# Altium project SnippetsPower.PrjPCB
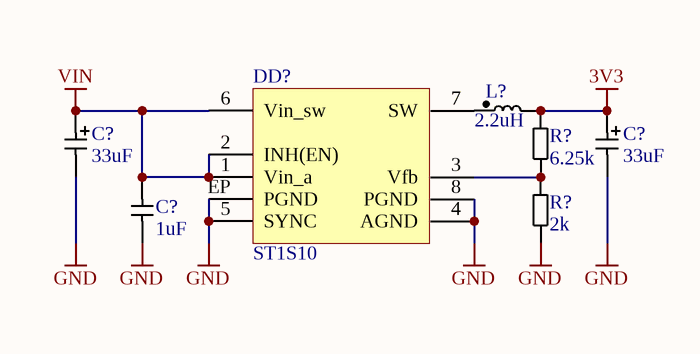
[diagram p0: DCDC_ST1S10_3V3.SchDoc]
8 sheets, 83 parts. Net scope: global (net labels, ports and power ports of the same name join across sheets).
Sheets:
  DCDC_ST1S10_3V3.SchDoc
  DCDC_ST1S10_3V3_small.SchDoc
  Measurement_CS5463_simple.SchDoc
  DCDC_TPS62200_3V3.SchDoc
  DCDC_TPS62410_1V1_1V2.SchDoc
  DCDC_TPS62410_1V8_2V5.SchDoc
  LDO_LP2992IM5_3V3.SchDoc
  DCDC_ST1S14_3.3V.SchDoc

## Sheet DCDC_ST1S10_3V3.SchDoc
size A4

### Parts
(Parts that share a designator on the sheet are numbered #1, #2 ... from top to bottom, then left to right.)
C?#1  33uF  [C_EL_6.3]
C?#2  33uF  [C_EL_6.3]
C?#3  1uF  [C0603]
DD?#1  ST1S10  [SO-8EP]
L?#1  2.2uH  [SDR0403]
R?#1  6.25k  [R0603]
R?#2  2k  [R0603]

### Nets
3V3: C?#2.1 L?#1.2 R?#1.2
GND: C?#1.2 C?#2.2 C?#3.2 DD?#1.4(AGND) DD?#1.5(SYNC) DD?#1.8(PGND) DD?#1.EP(PGND) R?#2.1  [project net HOT_L_IN]
VIN: C?#1.1 C?#3.1 DD?#1.1(Vin_a) DD?#1.2(INH(EN)) DD?#1.6(Vin_sw)
NetDD?#1_3: DD?#1.3(Vfb) R?#1.1 R?#2.2
NetDD?#1_7: DD?#1.7(SW) L?#1.1

### Library data of the parts
C?#1 C?#2 = CP: Capacitor polarized
C?#3 = C: Capacitor
DD?#1 = ST1S10: ST DC-DC Converter
L?#1 = L: Inductor
R?#1 R?#2 = R: Resistor

## Sheet DCDC_ST1S10_3V3_small.SchDoc
size A4
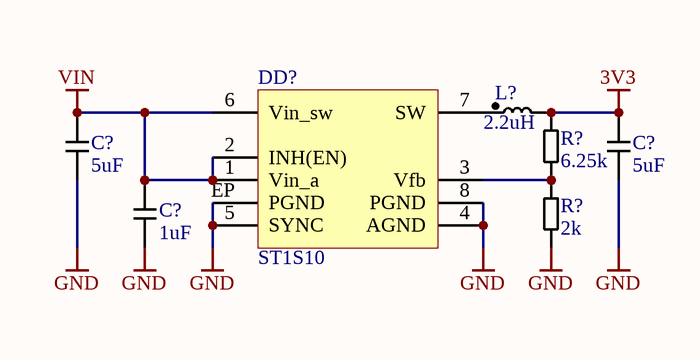
[diagram p1: DCDC_ST1S10_3V3_small.SchDoc]

### Parts
(Parts that share a designator on the sheet are numbered #1, #2 ... from top to bottom, then left to right.)
C?#4  5uF  [C0603]
C?#5  5uF  [C0603]
C?#6  1uF  [C0603]
DD?#2  ST1S10  [SO-8EP]
L?#2  2.2uH  [SDR0403]
R?#3  6.25k  [R0603]
R?#4  2k  [R0603]

### Nets
3V3: C?#5.1 L?#2.2 R?#3.2
GND: C?#4.2 C?#5.2 C?#6.2 DD?#2.4(AGND) DD?#2.5(SYNC) DD?#2.8(PGND) DD?#2.EP(PGND) R?#4.1  [project net HOT_L_IN]
VIN: C?#4.1 C?#6.1 DD?#2.1(Vin_a) DD?#2.2(INH(EN)) DD?#2.6(Vin_sw)
NetDD?#2_3: DD?#2.3(Vfb) R?#3.1 R?#4.2
NetDD?#2_7: DD?#2.7(SW) L?#2.1

### Library data of the parts
C?#4-C?#6 = C: Capacitor
DD?#2 = ST1S10: ST DC-DC Converter
L?#2 = L: Inductor
R?#3 R?#4 = R: Resistor

## Sheet Measurement_CS5463_simple.SchDoc
size A4
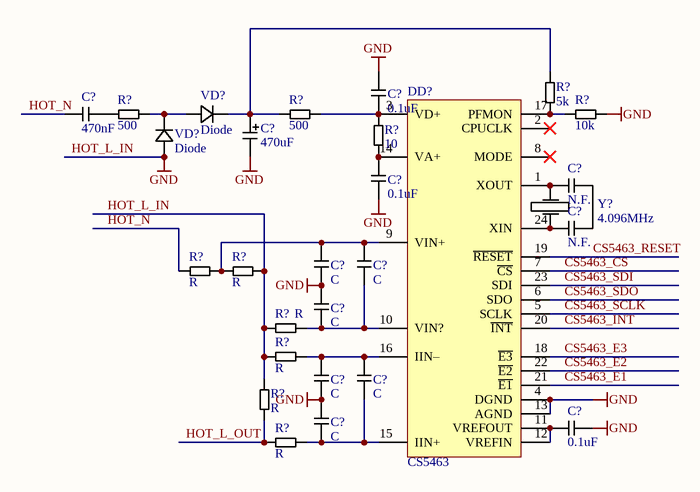
[diagram p2: Measurement_CS5463_simple.SchDoc]

### Parts
(Parts that share a designator on the sheet are numbered #1, #2 ... from top to bottom, then left to right.)
C?#7  0.1uF  [C0603]
C?#8  470nF  [C0603]
C?#9  470uF  [C_EL_6.3]
C?#10  0.1uF  [C0603]
C?#11  N.F.  [C0603]
C?#12  N.F.  [C0603]
C?#13  C  [C0603]
C?#14  C  [C0603]
C?#15  C  [C0603]
C?#16  C  [C0603]
C?#17  C  [C0603]
C?#18  C  [C0603]
C?#19  0.1uF  [C0603]
DD?#3  CS5463  [TSSOP-24]
R?#5  5k  [R0603]
R?#6  500  [R0603]
R?#7  500  [R0603]
R?#8  10k  [R0603]
R?#9  10  [R0603]
R?#10  R  [R0603]
R?#11  R  [R0603]
R?#12  R  [R0603]
R?#13  R  [R0603]
R?#14  R  [R0805]
R?#15  R  [R0603]
VD?#1  Diode  [SOD-123]
VD?#2  Diode  [SOD-123]
Y?  4.096MHz  [Xtal 0532]

### Nets
HOT_L_IN: C?#7.1 C?#9.2 C?#10.2 C?#13.2 C?#15.1 C?#16.2 C?#18.1 C?#19.2 DD?#3.4(DGND) DD?#3.13(AGND) R?#8.2 R?#11.2 R?#12.1 R?#13.1 R?#14.2 VD?#2.1(K)  [also labelled GND]
CS5463_CS: DD?#3.7(~{CS})
CS5463_E1: DD?#3.21(~{E1})
CS5463_E2: DD?#3.22(~{E2})
CS5463_E3: DD?#3.18(~{E3})
CS5463_INT: DD?#3.20(~{INT})
CS5463_RESET: DD?#3.19(~{RESET})
CS5463_SCLK: DD?#3.5(SCLK)
CS5463_SDI: DD?#3.23(SDI)
CS5463_SDO: DD?#3.6(SDO)
HOT_L_OUT: R?#14.1 R?#15.1
HOT_N: C?#8.1 R?#10.1
NetC?#7_2: C?#7.2 DD?#3.3(VD+) R?#7.2 R?#9.2
NetC?#8_2: C?#8.2 R?#6.1
NetC?#9_1: C?#9.1 R?#5.2 R?#7.1 VD?#1.2(A)
NetC?#10_1: C?#10.1 DD?#3.14(VA+) R?#9.1
NetC?#11_1: C?#11.1 DD?#3.1(XOUT) Y?.4(GND)
NetC?#11_2: C?#11.2 Y?.3(X2)
NetC?#12_1: C?#12.1 DD?#3.24(XIN) Y?.2(GND)
NetC?#12_2: C?#12.2 Y?.1(X1)
NetC?#13_1: C?#13.1 C?#14.1 DD?#3.9(VIN+) R?#10.2 R?#11.1
NetC?#14_2: C?#14.2 C?#15.2 DD?#3.10(VIN?) R?#12.2
NetC?#16_1: C?#16.1 C?#17.1 DD?#3.16(IIN–) R?#13.2
NetC?#17_2: C?#17.2 C?#18.2 DD?#3.15(IIN+) R?#15.2
NetC?#19_1: C?#19.1 DD?#3.11(VREFOUT) DD?#3.12(VREFIN)
NetDD?#3_17: DD?#3.17(PFMON) R?#5.1 R?#8.1
NetR?#6_2: R?#6.2 VD?#1.1(K) VD?#2.2(A)

Not connected (* = marked no-connect by the designer): DD?#3 2(CPUCLK)* 8(MODE)*

### Library data of the parts
C?#7 C?#8 C?#10-C?#19 = C: Capacitor
C?#9 = CP: Capacitor polarized
DD?#3 = CS5463: Power/Energy metering IC
R?#5-R?#15 = R: Resistor
VD?#1 VD?#2 = Diode: SMD diode
Y? = Xtal: Quartz crystal

## Sheet DCDC_TPS62200_3V3.SchDoc
size A4
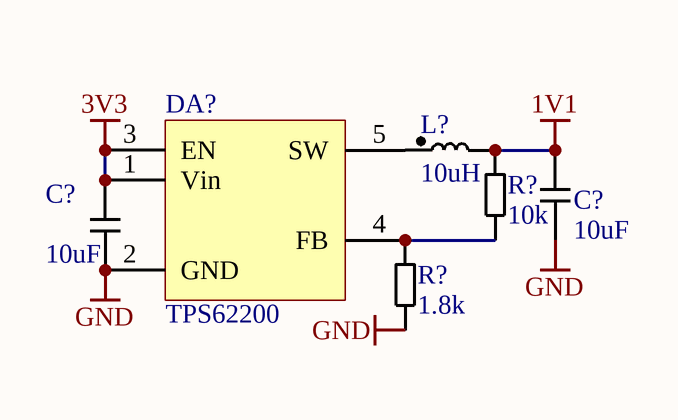
[diagram p3: DCDC_TPS62200_3V3.SchDoc]

### Parts
(Parts that share a designator on the sheet are numbered #1, #2 ... from top to bottom, then left to right.)
C?#20  10uF  [C0603]
C?#21  10uF  [C0603]
DA?#1  TPS62200  [SOT-23-5]
L?#3  10uH  [L0805]
R?#16  10k  [R0603]
R?#17  1.8k  [R0603]

### Nets
1V1: C?#20.1 L?#3.2 R?#16.2
3V3: C?#21.1 DA?#1.1(Vin) DA?#1.3(EN)
GND: C?#20.2 C?#21.2 DA?#1.2(GND) R?#17.1  [project net HOT_L_IN]
NetDA?#1_4: DA?#1.4(FB) R?#16.1 R?#17.2
NetDA?#1_5: DA?#1.5(SW) L?#3.1

### Library data of the parts
C?#20 C?#21 = C: Capacitor
DA?#1 = TPS62200: TI DC-DC buck 300ma SOT-23-5 package
L?#3 = L: Inductor
R?#16 R?#17 = R: Resistor

## Sheet DCDC_TPS62410_1V1_1V2.SchDoc
size A4
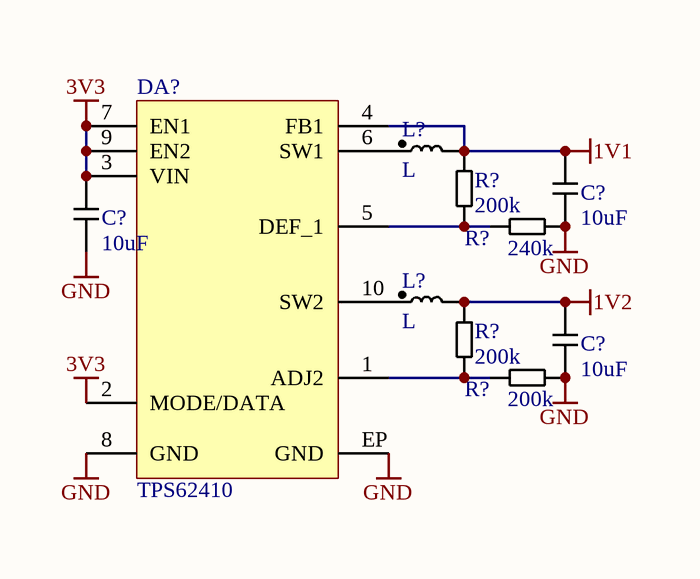
[diagram p4: DCDC_TPS62410_1V1_1V2.SchDoc]

### Parts
(Parts that share a designator on the sheet are numbered #1, #2 ... from top to bottom, then left to right.)
C?#22  10uF  [C0603]
C?#23  10uF  [C0603]
C?#24  10uF  [C0603]
DA?#2  TPS62410  [VSON-10]
L?#4  L  [L0603]
L?#5  L  [L0603]
R?#18  200k  [R0603]
R?#19  240k  [R0603]
R?#20  200k  [R0603]
R?#21  200k  [R0603]

### Nets
1V1: C?#22.1 DA?#2.4(FB1) L?#4.2 R?#18.2
1V2: C?#24.1 L?#5.2 R?#20.2
3V3: C?#23.1 DA?#2.2(MODE/DATA) DA?#2.3(VIN) DA?#2.7(EN1) DA?#2.9(EN2)
GND: C?#22.2 C?#23.2 C?#24.2 DA?#2.8(GND) DA?#2.EP(GND) R?#19.1 R?#21.1  [project net HOT_L_IN]
NetDA?#2_1: DA?#2.1(ADJ2) R?#20.1 R?#21.2
NetDA?#2_5: DA?#2.5(DEF_1) R?#18.1 R?#19.2
NetDA?#2_6: DA?#2.6(SW1) L?#4.1
NetDA?#2_10: DA?#2.10(SW2) L?#5.1

### Library data of the parts
C?#22-C?#24 = C: Capacitor
DA?#2 = TPS62410: TI 2 channel DC-DC buck
L?#4 L?#5 = L: Inductor
R?#18-R?#21 = R: Resistor

## Sheet DCDC_TPS62410_1V8_2V5.SchDoc
size A4
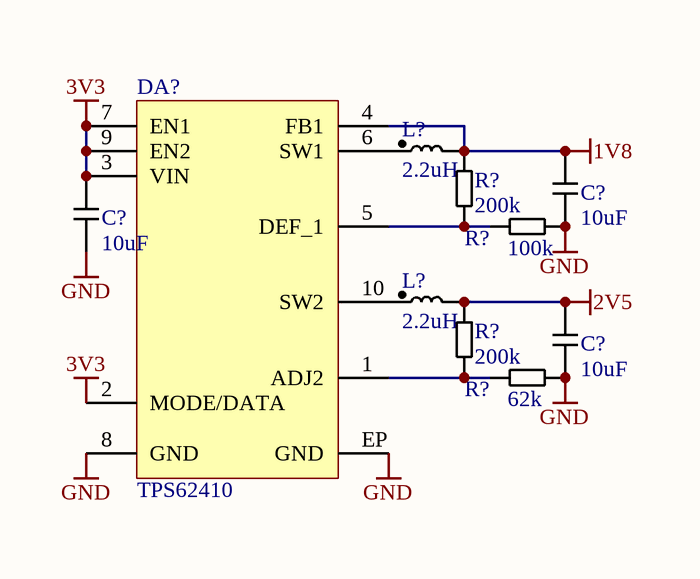
[diagram p5: DCDC_TPS62410_1V8_2V5.SchDoc]

### Parts
(Parts that share a designator on the sheet are numbered #1, #2 ... from top to bottom, then left to right.)
C?#25  10uF  [C0603]
C?#26  10uF  [C0603]
C?#27  10uF  [C0603]
DA?#3  TPS62410  [VSON-10]
L?#6  2.2uH  [L0603]
L?#7  2.2uH  [L0603]
R?#22  200k  [R0603]
R?#23  100k  [R0603]
R?#24  200k  [R0603]
R?#25  62k  [R0603]

### Nets
1V8: C?#25.1 DA?#3.4(FB1) L?#6.2 R?#22.2
2V5: C?#27.1 L?#7.2 R?#24.2
3V3: C?#26.1 DA?#3.2(MODE/DATA) DA?#3.3(VIN) DA?#3.7(EN1) DA?#3.9(EN2)
GND: C?#25.2 C?#26.2 C?#27.2 DA?#3.8(GND) DA?#3.EP(GND) R?#23.1 R?#25.1  [project net HOT_L_IN]
NetDA?#3_1: DA?#3.1(ADJ2) R?#24.1 R?#25.2
NetDA?#3_5: DA?#3.5(DEF_1) R?#22.1 R?#23.2
NetDA?#3_6: DA?#3.6(SW1) L?#6.1
NetDA?#3_10: DA?#3.10(SW2) L?#7.1

### Library data of the parts
C?#25-C?#27 = C: Capacitor
DA?#3 = TPS62410: TI 2 channel DC-DC buck
L?#6 L?#7 = L: Inductor
R?#22-R?#25 = R: Resistor

## Sheet LDO_LP2992IM5_3V3.SchDoc
size A4
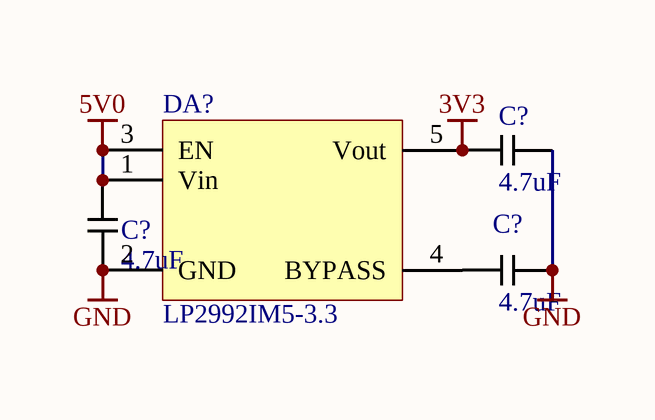
[diagram p6: LDO_LP2992IM5_3V3.SchDoc]

### Parts
(Parts that share a designator on the sheet are numbered #1, #2 ... from top to bottom, then left to right.)
C?#28  4.7uF  [C0603]
C?#29  4.7uF  [C0603]
C?#30  4.7uF  [C0603]
DA?#4  LP2992IM5-3.3  [SOT-23-5]

### Nets
3V3: C?#28.2 DA?#4.5(Vout)
5V0: C?#29.1 DA?#4.1(Vin) DA?#4.3(EN)
GND: C?#28.1 C?#29.2 C?#30.1 DA?#4.2(GND)  [project net HOT_L_IN]
NetC?#30_2: C?#30.2 DA?#4.4(BYPASS)

### Library data of the parts
C?#28-C?#30 = C: Capacitor
DA?#4 = LP2992IM5: TI LDO

## Sheet DCDC_ST1S14_3.3V.SchDoc
size A4
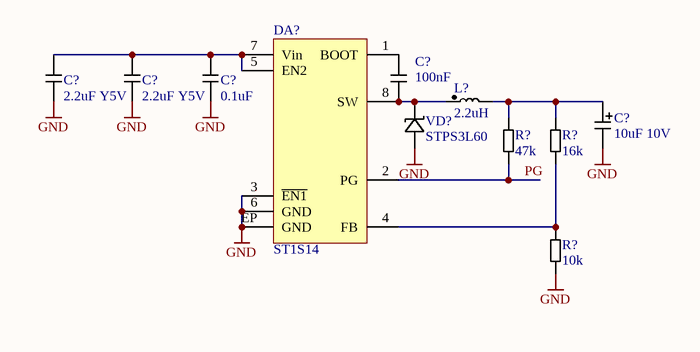
[diagram p7: DCDC_ST1S14_3.3V.SchDoc]

### Parts
(Parts that share a designator on the sheet are numbered #1, #2 ... from top to bottom, then left to right.)
C?#31  2.2uF Y5V  [C0805]
C?#32  2.2uF Y5V  [C0805]
C?#33  0.1uF  [C0603]
C?#34  100nF  [C0603]
C?#35  10uF 10V  [SMD A]
DA?#5  ST1S14  [SO-8EP]
L?#8  2.2uH  [NR60]
R?#26  47k  [R0603]
R?#27  16k  [R0603]
R?#28  10k  [R0603]
VD?#3  STPS3L60  [SMB]

### Nets
GND: C?#31.2 C?#32.2 C?#33.2 C?#35.2 DA?#5.3(~{EN1}) DA?#5.6(GND) DA?#5.EP(GND) R?#28.1 VD?#3.1(K)  [project net HOT_L_IN]
PG: DA?#5.2(PG) R?#26.1
NetC?#31_1: C?#31.1 C?#32.1 C?#33.1 DA?#5.5(EN2) DA?#5.7(Vin)
NetC?#34_1: C?#34.1 DA?#5.1(BOOT)
NetC?#34_2: C?#34.2 DA?#5.8(SW) L?#8.1 VD?#3.2(A)
NetC?#35_1: C?#35.1 L?#8.2 R?#26.2 R?#27.2
NetDA?#5_4: DA?#5.4(FB) R?#27.1 R?#28.2

### Library data of the parts
C?#31-C?#34 = C: Capacitor
C?#35 = CP: Capacitor polarized
DA?#5 = ST1S14: ST DC-DC converter
L?#8 = L: Inductor
R?#26-R?#28 = R: Resistor
VD?#3 = STPS3L60: ST diode

## Nets that join several sheets
1V1: DCDC_TPS62200_3V3 (C?#20.1 L?#3.2 R?#16.2), DCDC_TPS62410_1V1_1V2 (C?#22.1 DA?#2.4 L?#4.2 R?#18.2)
3V3: DCDC_ST1S10_3V3 (C?#2.1 L?#1.2 R?#1.2), DCDC_ST1S10_3V3_small (C?#5.1 L?#2.2 R?#3.2), DCDC_TPS62200_3V3 (C?#21.1 DA?#1.1 DA?#1.3), DCDC_TPS62410_1V1_1V2 (5 pins), DCDC_TPS62410_1V8_2V5 (5 pins), LDO_LP2992IM5_3V3 (C?#28.2 DA?#4.5)
HOT_L_IN: DCDC_ST1S10_3V3 (8 pins), DCDC_ST1S10_3V3_small (8 pins), Measurement_CS5463_simple (16 pins), DCDC_TPS62200_3V3 (C?#20.2 C?#21.2 DA?#1.2 R?#17.1), DCDC_TPS62410_1V1_1V2 (7 pins), DCDC_TPS62410_1V8_2V5 (7 pins), LDO_LP2992IM5_3V3 (C?#28.1 C?#29.2 C?#30.1 DA?#4.2), DCDC_ST1S14_3.3V (9 pins)
VIN: DCDC_ST1S10_3V3 (5 pins), DCDC_ST1S10_3V3_small (5 pins)